# Altium schematic sheet p3_mcu.SchDoc
size A2; Organization: ORGANIZATION; Address1: ADDRESS 1; Address2: ADDRESS 2; Address3: ADDRESS 3; Address4: ADDRESS 4; Revision: Rev. A; SheetNumber: 3; SheetTotal: 8; ENG_APP_DATE: --/--/--; DSN_APP_DATE: --/--/--; CHK_APP_DATE: --/--/--
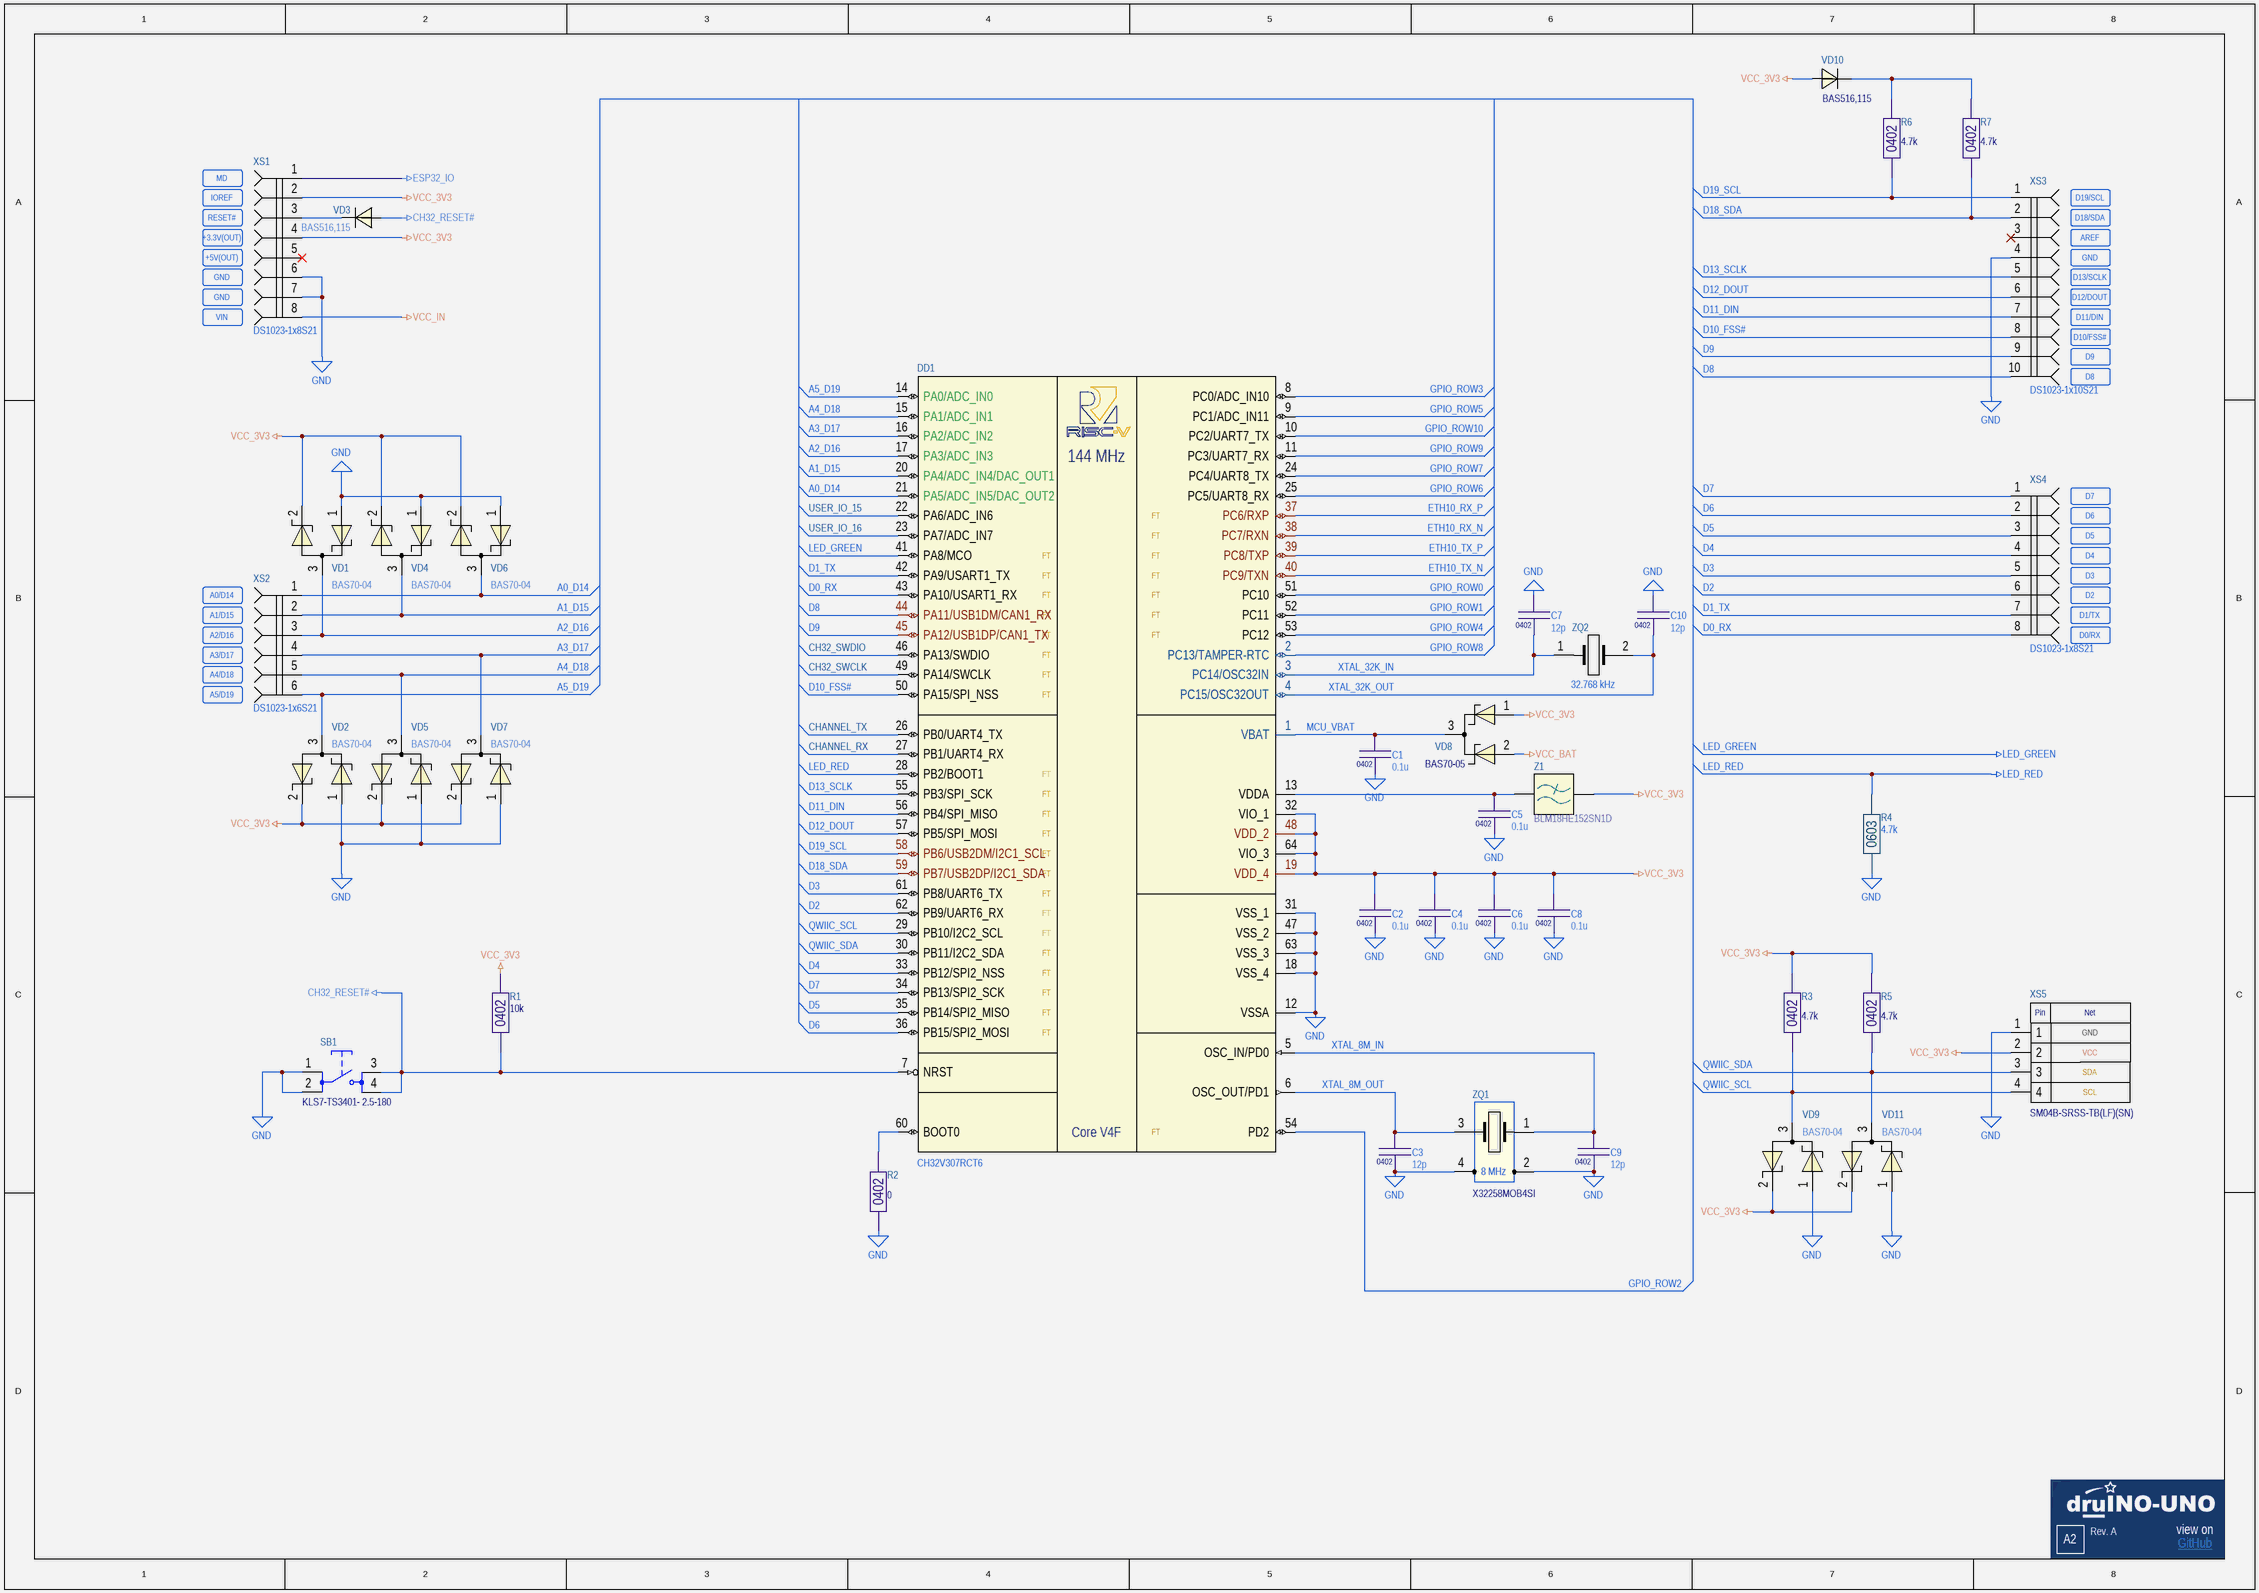
[diagram p0: p3_mcu.SchDoc]

## Parts
C1  0.1u  Package: 0402  [CAP0402]
C2  0.1u  Package: 0402  [CAP0402]
C3  12p  Package: 0402  [CAP0402]
C4  0.1u  Package: 0402  [CAP0402]
C5  0.1u  Package: 0402  [CAP0402]
C6  0.1u  Package: 0402  [CAP0402]
C7  12p  Package: 0402  [CAP0402]
C8  0.1u  Package: 0402  [CAP0402]
C9  12p  Package: 0402  [CAP0402]
C10  12p  Package: 0402  [CAP0402]
DD1  CH32V307RCT6  [LQFP64M]
R1  10k  Package: 0402  [RES0402B]
R2  0  Package: 0402  [RES0402B]
R3  4.7k  Package: 0402  [RES0402B]
R4  4.7k  Package: 0603  [RES0603B]
R5  4.7k  Package: 0402  [RES0402B]
R6  4.7k  Package: 0402  [RES0402B]
R7  4.7k  Package: 0402  [RES0402B]
SB1  KLS7-TS3401- 2.5-180  [TVAF11]
VD1  BAS70-04  [SOT23-3]
VD2  BAS70-04  [SOT23-3]
VD3  BAS516,115  [SOD-523]
VD4  BAS70-04  [SOT23-3]
VD5  BAS70-04  [SOT23-3]
VD6  BAS70-04  [SOT23-3]
VD7  BAS70-04  [SOT23-3]
VD8  BAS70-05  [SOT23-3]
VD9  BAS70-04  [SOT23-3]
VD10  BAS516,115  [SOD-523]
VD11  BAS70-04  [SOT23-3]
XS1  DS1023-1x8S21  [PBS-8(BLUE)]
XS2  DS1023-1x6S21  [PBS-6(blue)]
XS3  DS1023-1x10S21  [PBS-10(BLUE)]
XS4  DS1023-1x8S21  [PBS-8(BLUE)]
XS5  SM04B-SRSS-TB(LF)(SN)  [SM04B-SRSS-TB]
Z1  BLM18HE152SN1D  [BLM0603C]
ZQ1  X32258MOB4SI  [SMD3225]
ZQ2  X321532768KGD2SI  [YST310S]  (value not drawn)

## Nets
CH32_RESET#: DD1.7(NRST) R1.2 SB1.3 SB1.4 VD3.2
ESP32_IO: XS1.1
GND: C1.2 C2.2 C3.2 C4.2 C5.2 C6.2 C7.1 C8.2 C9.2 C10.1 DD1.12(VSSA) DD1.18(VSS_4) DD1.31(VSS_1) DD1.47(VSS_2) DD1.63(VSS_3) R2.2 R4.2 SB1.1 SB1.2 VD1.1(A1) VD2.1(A1) VD4.1(A1) VD5.1(A1) VD6.1(A1) VD7.1(A1) VD9.1(A1) VD11.1(A1) XS1.6 XS1.7 XS3.4 XS5.1 ZQ1.2(GND) ZQ1.4(GND)
LED_GREEN: DD1.41(PA8/MCO)
LED_RED: DD1.28(PB2/BOOT1) R4.1
VCC_3V3: C2.1 C4.1 C6.1 C8.1 DD1.19(VDD_4) DD1.32(VIO_1) DD1.48(VDD_2) DD1.64(VIO_3) R1.1 R3.1 R5.1 VD1.2(C) VD2.2(C) VD4.2(C) VD5.2(C) VD6.2(C) VD7.2(C) VD8.1(A1) VD9.2(C) VD10.2 VD11.2(C) XS1.2 XS1.4 XS5.2 Z1.1
VCC_BAT: VD8.2(C)
VCC_IN: XS1.8
A0_D14: DD1.21(PA5/ADC_IN5/DAC_OUT2) VD6.3(A2) XS2.1
A1_D15: DD1.20(PA4/ADC_IN4/DAC_OUT1) VD4.3(A2) XS2.2
A2_D16: DD1.17(PA3/ADC_IN3) VD1.3(A2) XS2.3
A3_D17: DD1.16(PA2/ADC_IN2) VD7.3(A2) XS2.4
A4_D18: DD1.15(PA1/ADC_IN1) VD5.3(A2) XS2.5
A5_D19: DD1.14(PA0/ADC_IN0) VD2.3(A2) XS2.6
CH32_SWCLK: DD1.49(PA14/SWCLK)
CH32_SWDIO: DD1.46(PA13/SWDIO)
CHANNEL_RX: DD1.27(PB1/UART4_RX)
CHANNEL_TX: DD1.26(PB0/UART4_TX)
D0_RX: DD1.43(PA10/USART1_RX) XS4.8
D1_TX: DD1.42(PA9/USART1_TX) XS4.7
D2: DD1.62(PB9/UART6_RX) XS4.6
D3: DD1.61(PB8/UART6_TX) XS4.5
D4: DD1.33(PB12/SPI2_NSS) XS4.4
D5: DD1.35(PB14/SPI2_MISO) XS4.3
D6: DD1.36(PB15/SPI2_MOSI) XS4.2
D7: DD1.34(PB13/SPI2_SCK) XS4.1
D8: DD1.44(PA11/USB1DM/CAN1_RX) XS3.10
D9: DD1.45(PA12/USB1DP/CAN1_TX) XS3.9
D10_FSS#: DD1.50(PA15/SPI_NSS) XS3.8
D11_DIN: DD1.56(PB4/SPI_MISO) XS3.7
D12_DOUT: DD1.57(PB5/SPI_MOSI) XS3.6
D13_SCLK: DD1.55(PB3/SPI_SCK) XS3.5
D18_SDA: DD1.59(PB7/USB2DP/I2C1_SDA) R7.2 XS3.2
D19_SCL: DD1.58(PB6/USB2DM/I2C1_SCL) R6.2 XS3.1
ETH10_RX_N: DD1.38(PC7/RXN)
ETH10_RX_P: DD1.37(PC6/RXP)
ETH10_TX_N: DD1.40(PC9/TXN)
ETH10_TX_P: DD1.39(PC8/TXP)
GPIO_ROW0: DD1.51(PC10)
GPIO_ROW1: DD1.52(PC11)
GPIO_ROW2: DD1.54(PD2)
GPIO_ROW3: DD1.8(PC0/ADC_IN10)
GPIO_ROW4: DD1.53(PC12)
GPIO_ROW5: DD1.9(PC1/ADC_IN11)
GPIO_ROW6: DD1.25(PC5/UART8_RX)
GPIO_ROW7: DD1.24(PC4/UART8_TX)
GPIO_ROW8: DD1.2(PC13/TAMPER-RTC)
GPIO_ROW9: DD1.11(PC3/UART7_RX)
GPIO_ROW10: DD1.10(PC2/UART7_TX)
MCU_VBAT: C1.1 DD1.1(VBAT) VD8.3(A2)
QWIIC_SCL: DD1.29(PB10/I2C2_SCL) R3.2 VD9.3(A2) XS5.4
QWIIC_SDA: DD1.30(PB11/I2C2_SDA) R5.2 VD11.3(A2) XS5.3
USER_IO_15: DD1.22(PA6/ADC_IN6)
USER_IO_16: DD1.23(PA7/ADC_IN7)
XTAL_8M_IN: C9.1 DD1.5(OSC_IN/PD0) ZQ1.1(XTAL0)
XTAL_8M_OUT: C3.1 DD1.6(OSC_OUT/PD1) ZQ1.3(XTAL1)
XTAL_32K_IN: C7.2 DD1.3(PC14/OSC32IN) ZQ2.1(XTAL0)
XTAL_32K_OUT: C10.2 DD1.4(PC15/OSC32OUT) ZQ2.2(XTAL1)
NetC5_1: C5.1 DD1.13(VDDA) Z1.2
NetDD1_60: DD1.60(BOOT0) R2.1
NetR6_1: R6.1 R7.1 VD10.1
NetVD3_1: VD3.1 XS1.3

Not connected (* = marked no-connect by the designer): XS1 5*; XS3 3*

## Notes on the sheet
- MD
- IOREF
- D19/SCL
- RESET#
- (near XS1) +3.3V(OUT)
- D18/SDA
- AREF
- +5V(OUT)
- GND
- D13/SCLK
- D12/DOUT
- VIN
- D11/DIN
- D10/FSS#
- D9
- D8
- D7
- (near DD1) FT
- D6
- D5
- A0/D14
- D4
- D3
- D2
- A1/D15
- A2/D16
- A3/D17
- D1/TX
- D0/RX
- A4/D18
- A5/D19
- A2
- GitHub <https://github.com/kirra-cat/druino-uno>
- view on
- (in symbol CH32V307RCT6) 144 MHz; Core V4F
- (in symbol SM04B-SRSS-TB) Pin; Net; GND; VCC; SDA; SCL
- (in symbol X32258MOB4SI) 8 MHz
- (in symbol X321532768KGD2SI) 32.768 kHz

## Library data of the parts
C1 C2 C4-C6 C8 = C0402: Capacitors 0402 package case; Part Number: TCC0402X7R104J500AT; Manufacturer: CCTC; Tolerance: ± 5 %; Dielectric: X7R; Voltage: 50 V; Value: 0.1u; Value on schem: 0.1u
C3 C7 C9 C10 = C0402: Capacitors 0402 package case; Part Number: TCC0402COG120F500AT; Manufacturer: CCTC; Tolerance: ± 1 %; Dielectric: NP0; Voltage: 50 V; Value: 12p; Value on schem: 12p
DD1 = CH32V307RCT6: RISC-V MCU 144MHz with 256KB flash, 64KB RAM; Manufacturer: WinChipHead; Package: LQFP-64; Part Number: CH32V307RCT6
R1 = R0402: Resistor 0402 package case; Part Number: RC0402FR-0710KL; Manufacturer: Yageo; Tolerance: ± 1 %; Temperature Coefficient: ±100 ppm/K; Value: 10k; Value on schem: 10k
R2 = R0402: Resistor 0402 package case; Part Number: RC0402FR-070RL; Manufacturer: Yageo; Tolerance: ± 1 %; Temperature Coefficient: ±100 ppm/K; Value: 0; Value on schem: 0
R3 R5-R7 = R0402: Resistor 0402 package case; Part Number: RC0402FR-074K7L; Manufacturer: Yageo; Tolerance: ± 1 %; Temperature Coefficient: ±100 ppm/K; Value: 4.7k; Value on schem: 4.7k
R4 = R0603: Resistor 0603 package case; Part Number: RC0603FR-074K7L; Manufacturer: Yageo; Tolerance: ± 1 %; Voltage: 100V; Temperature Coefficient: ±100/K; Value: 4.7k; Value on schem: 4.7k
SB1 = TVAF11: Tact Button SMD 4х3х2.5mm; Manufacturer: KLS; Package: 3x4mm; Part Number: KLS7-TS3401- 2.5-180
VD1 VD2 VD4-VD7 VD9 VD11 = BAS70-04: Small Signal Schottky Diodes; Manufacturer: Diodes Incorporated; Part Number: BAS70-04; Package: SOT23-3
VD3 VD10 = BAS516,115: High-speed switching diode; Manufacturer: NXP USA Inc.; Package: SOD-523; Part Number: BAS516,115
VD8 = BAS70-05: Small Signal Schottky Diodes; Manufacturer: Diodes Incorporated; Part Number: BAS70-05; Package: SOT23-3
XS1 XS4 = DS1023-1x8S21: 2.54mm Female Header V/T Type, H = 8.5mm; Manufacturer: Connfly; Part Number: DS1023-1x8S21
XS2 = DS1023-1x6S21: 2.54mm Female Header V/T Type, H = 8.5mm; Manufacturer: Connfly; Part Number: DS1023-1x6S21
XS3 = DS1023-1x10S21: 2.54mm Female Header V/T Type, H = 8.5mm; Manufacturer: Connfly; Part Number: DS1023-1x10S21
XS5 = SM04B-SRSS-TB: CONNECTOR, HEADER, SMT, R/A, 1MM, 4WAY; Manufacturer: JST; Part Number: SM04B-SRSS-TB(LF)(SN)
Z1 = BLM18HE152SN1D: Power line filter, imperdance 1500 Ohm @100MHz (current 0.5A); Manufacturer: Murata; Part Number: BLM18HE152SN1D; Package: 0603
ZQ1 = X32258MOB4SI: Quartz Crystal 8 MHz; Manufacturer: YXC; Load Capacitance: 12pF; Frequency Tolerance: ±20ppm; Frequency Stability: ±30ppm; ESR (Equivalent Series Resistance): 70 Ohms; Operating Mode: Fundamental; Part Number: X32258MOB4SI; Package: SMD3225
ZQ2 = X321532768KGD2SI: Quartz Crystal 32768 Hz; Manufacturer: YXC; Load Capacitance: 12.5 pF; Frequency Tolerance: ±20ppm; Frequency Stability: ±30ppm; ESR (Equivalent Series Resistance): 70 Ohms; Operating Mode: Fundamental; Part Number: X321532768KGD2SI; Package: SMD3215